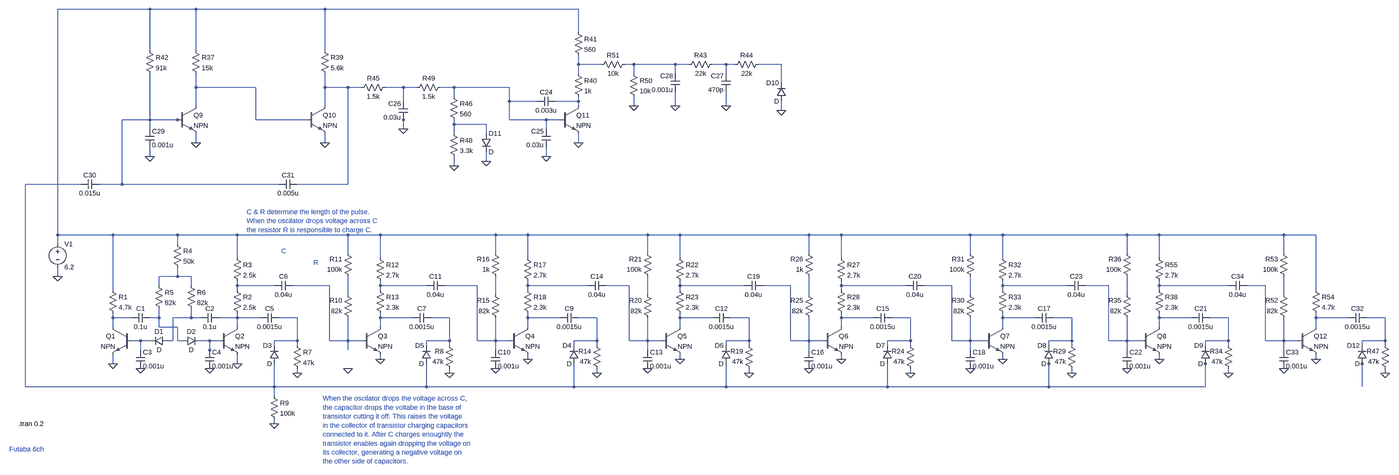
[diagram p0: schematic futaba-encoder-pulse-avalanche.asc, whole sheet]
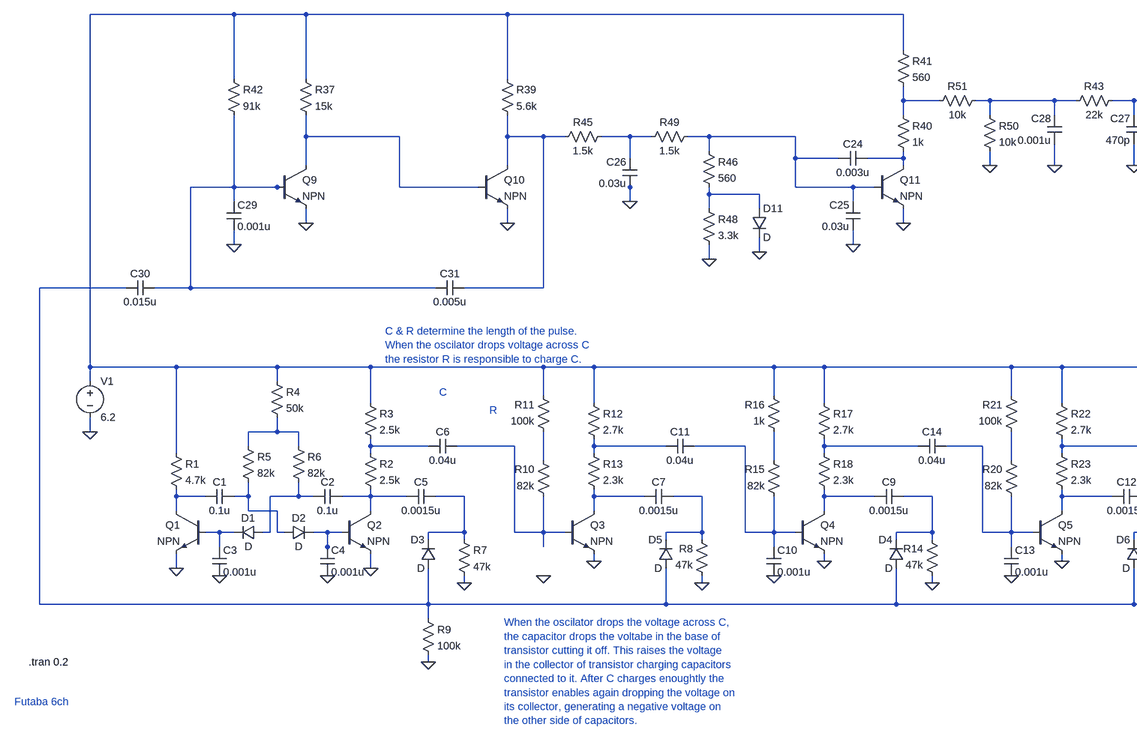
[diagram p1: schematic futaba-encoder-pulse-avalanche.asc, part, row 1 of 1, column 1 of 2]
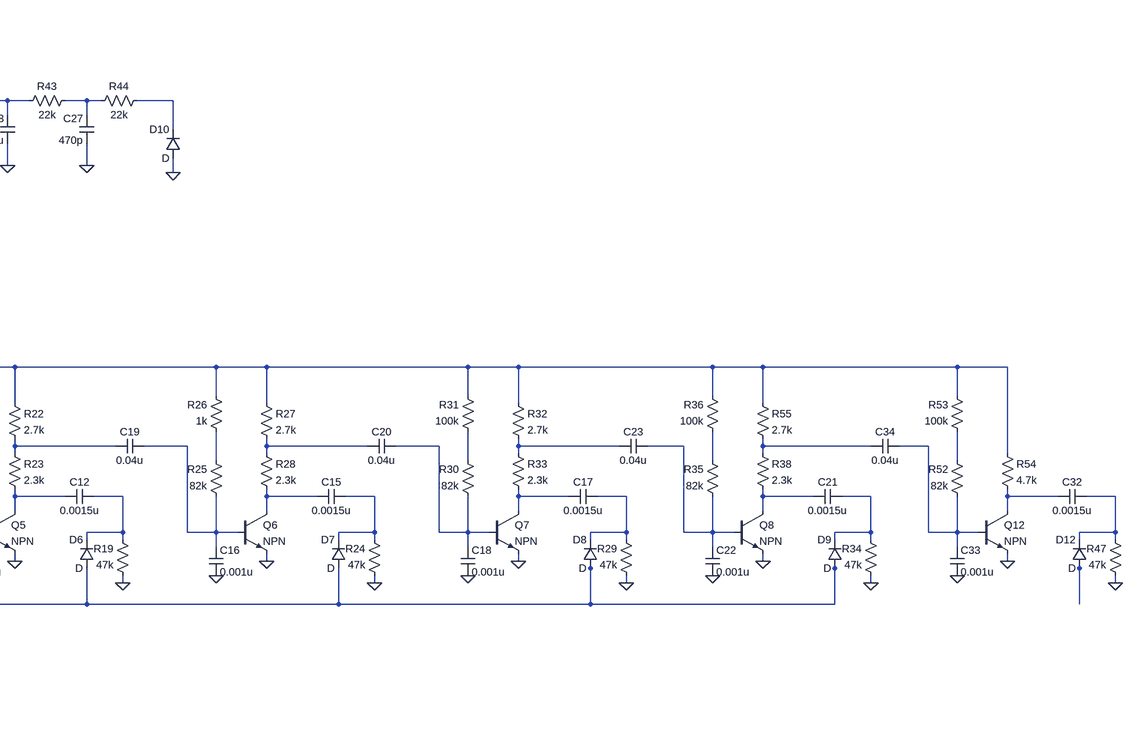
[diagram p2: schematic futaba-encoder-pulse-avalanche.asc, part, row 1 of 1, column 2 of 2]
futaba-encoder-pulse-avalanche.asc, the LTspice schematic file:
Version 4
SHEET 1 4308 792
WIRE 0 -752 -320 -752
WIRE 160 -752 0 -752
WIRE 608 -752 160 -752
WIRE 1488 -752 608 -752
WIRE 1488 -672 1488 -752
WIRE 0 -608 0 -752
WIRE 160 -608 160 -752
WIRE 608 -608 608 -752
WIRE 1488 -560 1488 -592
WIRE 1568 -560 1488 -560
WIRE 1680 -560 1648 -560
WIRE 1824 -560 1680 -560
WIRE 1872 -560 1824 -560
WIRE 2000 -560 1952 -560
WIRE 2032 -560 2000 -560
WIRE 2192 -560 2112 -560
WIRE 1488 -528 1488 -560
WIRE 1680 -528 1680 -560
WIRE 1824 -528 1824 -560
WIRE 2000 -528 2000 -560
WIRE 2192 -496 2192 -560
WIRE 160 -480 160 -528
WIRE 368 -480 160 -480
WIRE 608 -480 608 -528
WIRE 688 -480 608 -480
WIRE 736 -480 688 -480
WIRE 880 -480 816 -480
WIRE 928 -480 880 -480
WIRE 1056 -480 1008 -480
WIRE 1248 -480 1056 -480
WIRE 1056 -448 1056 -480
WIRE 880 -432 880 -480
WIRE 1248 -432 1248 -480
WIRE 1344 -432 1248 -432
WIRE 1488 -432 1488 -448
WIRE 1488 -432 1408 -432
WIRE 160 -416 160 -480
WIRE 608 -416 608 -480
WIRE 1488 -416 1488 -432
WIRE 1680 -416 1680 -448
WIRE 1824 -416 1824 -464
WIRE 2000 -416 2000 -464
WIRE 2192 -400 2192 -432
WIRE 0 -368 0 -528
WIRE 0 -368 -96 -368
WIRE 96 -368 0 -368
WIRE 112 -368 96 -368
WIRE 368 -368 368 -480
WIRE 544 -368 368 -368
WIRE 880 -368 880 -384
WIRE 1248 -368 1248 -432
WIRE 1376 -368 1248 -368
WIRE 1424 -368 1376 -368
WIRE 1056 -352 1056 -368
WIRE 1168 -352 1056 -352
WIRE 0 -336 0 -368
WIRE 880 -336 880 -368
WIRE 1376 -336 1376 -368
WIRE 1056 -320 1056 -352
WIRE 1168 -320 1168 -352
WIRE 160 -288 160 -320
WIRE 608 -288 608 -320
WIRE 1488 -288 1488 -320
WIRE 0 -240 0 -272
WIRE 1376 -240 1376 -272
WIRE 1168 -224 1168 -256
WIRE 1056 -208 1056 -240
WIRE -240 -144 -432 -144
WIRE -96 -144 -96 -368
WIRE -96 -144 -176 -144
WIRE 448 -144 -96 -144
WIRE 688 -144 688 -480
WIRE 688 -144 512 -144
WIRE -320 32 -320 -752
WIRE -128 32 -320 32
WIRE 96 32 -128 32
WIRE 304 32 96 32
WIRE 688 32 304 32
WIRE 800 32 688 32
WIRE 1200 32 800 32
WIRE 1312 32 1200 32
WIRE 1728 32 1312 32
WIRE 1840 32 1728 32
WIRE 2288 32 1840 32
WIRE 2400 32 2288 32
WIRE 2848 32 2400 32
WIRE 2960 32 2848 32
WIRE 3392 32 2960 32
WIRE 3504 32 3392 32
WIRE 3936 32 3504 32
WIRE 4048 32 3936 32
WIRE -320 64 -320 32
WIRE 96 64 96 32
WIRE 688 96 688 32
WIRE 1200 96 1200 32
WIRE 1728 96 1728 32
WIRE 2288 96 2288 32
WIRE 2848 96 2848 32
WIRE 3392 96 3392 32
WIRE 3936 96 3936 32
WIRE 304 112 304 32
WIRE 800 112 800 32
WIRE 1312 112 1312 32
WIRE 1840 112 1840 32
WIRE 2400 112 2400 32
WIRE 2960 112 2960 32
WIRE 3504 112 3504 32
WIRE -320 176 -320 144
WIRE 96 176 96 144
WIRE 96 176 32 176
WIRE 144 176 96 176
WIRE 32 208 32 176
WIRE 144 208 144 176
WIRE 304 208 304 192
WIRE 432 208 304 208
WIRE 624 208 496 208
WIRE 800 208 800 192
WIRE 960 208 800 208
WIRE 1136 208 1024 208
WIRE 1312 208 1312 192
WIRE 1520 208 1312 208
WIRE 1664 208 1584 208
WIRE 1840 208 1840 192
WIRE 2064 208 1840 208
WIRE 2224 208 2128 208
WIRE 2400 208 2400 192
WIRE 2624 208 2400 208
WIRE 2784 208 2688 208
WIRE 2960 208 2960 192
WIRE 3184 208 2960 208
WIRE 3328 208 3248 208
WIRE 3504 208 3504 192
WIRE 3744 208 3504 208
WIRE 3872 208 3808 208
WIRE -128 224 -128 32
WIRE 304 224 304 208
WIRE 800 224 800 208
WIRE 1312 224 1312 208
WIRE 1840 224 1840 208
WIRE 2400 224 2400 208
WIRE 2960 224 2960 208
WIRE 3504 224 3504 208
WIRE 4048 224 4048 32
WIRE 688 240 688 176
WIRE 1200 240 1200 176
WIRE 1728 240 1728 176
WIRE 2288 240 2288 176
WIRE 2848 240 2848 176
WIRE 3392 240 3392 176
WIRE 3936 240 3936 176
WIRE -128 320 -128 304
WIRE -64 320 -128 320
WIRE 32 320 32 288
WIRE 32 320 0 320
WIRE 144 320 144 288
WIRE 144 320 80 320
WIRE 176 320 144 320
WIRE 304 320 304 304
WIRE 304 320 240 320
WIRE 384 320 304 320
WIRE 512 320 448 320
WIRE 800 320 800 304
WIRE 912 320 800 320
WIRE 1040 320 976 320
WIRE 1312 320 1312 304
WIRE 1424 320 1312 320
WIRE 1552 320 1488 320
WIRE 1840 320 1840 304
WIRE 1952 320 1840 320
WIRE 2080 320 2016 320
WIRE 2400 320 2400 304
WIRE 2512 320 2400 320
WIRE 2640 320 2576 320
WIRE 2960 320 2960 304
WIRE 3072 320 2960 320
WIRE 3200 320 3136 320
WIRE 3504 320 3504 304
WIRE 3616 320 3504 320
WIRE 3744 320 3680 320
WIRE 4048 320 4048 304
WIRE 4160 320 4048 320
WIRE 4288 320 4224 320
WIRE -128 352 -128 320
WIRE 32 352 32 320
WIRE 96 352 32 352
WIRE 304 352 304 320
WIRE 800 352 800 320
WIRE 1312 352 1312 320
WIRE 1840 352 1840 320
WIRE 2400 352 2400 320
WIRE 2960 352 2960 320
WIRE 3504 352 3504 320
WIRE 4048 352 4048 320
WIRE -32 400 -64 400
WIRE 0 400 -32 400
WIRE 80 400 80 320
WIRE 80 400 64 400
WIRE 96 400 96 352
WIRE 112 400 96 400
WIRE 208 400 176 400
WIRE 240 400 208 400
WIRE 512 400 512 320
WIRE 512 400 432 400
WIRE 624 400 624 208
WIRE 688 400 688 320
WIRE 688 400 624 400
WIRE 736 400 688 400
WIRE 1040 400 1040 320
WIRE 1040 400 960 400
WIRE 1136 400 1136 208
WIRE 1200 400 1200 320
WIRE 1200 400 1136 400
WIRE 1248 400 1200 400
WIRE 1552 400 1552 320
WIRE 1552 400 1472 400
WIRE 1664 400 1664 208
WIRE 1728 400 1728 320
WIRE 1728 400 1664 400
WIRE 1776 400 1728 400
WIRE 2080 400 2080 320
WIRE 2080 400 2000 400
WIRE 2224 400 2224 208
WIRE 2288 400 2288 320
WIRE 2288 400 2224 400
WIRE 2336 400 2288 400
WIRE 2640 400 2640 320
WIRE 2640 400 2560 400
WIRE 2784 400 2784 208
WIRE 2848 400 2848 320
WIRE 2848 400 2784 400
WIRE 2896 400 2848 400
WIRE 3200 400 3200 320
WIRE 3200 400 3120 400
WIRE 3328 400 3328 208
WIRE 3392 400 3392 320
WIRE 3392 400 3328 400
WIRE 3440 400 3392 400
WIRE 3744 400 3744 320
WIRE 3744 400 3664 400
WIRE 3872 400 3872 208
WIRE 3936 400 3936 320
WIRE 3936 400 3872 400
WIRE 3984 400 3936 400
WIRE 4288 400 4288 320
WIRE 4288 400 4208 400
WIRE 432 416 432 400
WIRE 512 416 512 400
WIRE 960 416 960 400
WIRE 1040 416 1040 400
WIRE 1472 416 1472 400
WIRE 1552 416 1552 400
WIRE 2000 416 2000 400
WIRE 2080 416 2080 400
WIRE 2560 416 2560 400
WIRE 2640 416 2640 400
WIRE 3120 416 3120 400
WIRE 3200 416 3200 400
WIRE 3664 416 3664 400
WIRE 3744 416 3744 400
WIRE 4208 416 4208 400
WIRE 4288 416 4288 400
WIRE -32 432 -32 400
WIRE 208 432 208 400
WIRE 688 432 688 400
WIRE 1200 432 1200 400
WIRE 1728 432 1728 400
WIRE 2288 432 2288 400
WIRE 2848 432 2848 400
WIRE 3392 432 3392 400
WIRE 3936 432 3936 400
WIRE 208 448 208 432
WIRE 800 464 800 448
WIRE 1312 464 1312 448
WIRE 1840 464 1840 448
WIRE 2400 464 2400 448
WIRE 2960 464 2960 448
WIRE 3504 464 3504 448
WIRE 4048 464 4048 448
WIRE -128 480 -128 448
WIRE 304 480 304 448
WIRE 3120 480 3120 464
WIRE 3664 480 3664 464
WIRE 4208 480 4208 464
WIRE 512 512 512 496
WIRE 1040 512 1040 496
WIRE 1552 512 1552 496
WIRE 2080 512 2080 496
WIRE 2640 512 2640 496
WIRE 3200 512 3200 496
WIRE 3744 512 3744 496
WIRE 4288 512 4288 496
WIRE -432 560 -432 -144
WIRE 432 560 432 480
WIRE 432 560 -432 560
WIRE 960 560 960 480
WIRE 960 560 432 560
WIRE 1472 560 1472 480
WIRE 1472 560 960 560
WIRE 2000 560 2000 480
WIRE 2000 560 1472 560
WIRE 2560 560 2560 480
WIRE 2560 560 2000 560
WIRE 3120 560 3120 480
WIRE 3120 560 2560 560
WIRE 3664 560 3664 480
WIRE 3664 560 3120 560
WIRE 4208 560 4208 480
WIRE 432 592 432 560
WIRE 432 688 432 672
FLAG -128 480 0
FLAG 304 480 0
FLAG -320 176 0
FLAG 512 512 0
FLAG 432 688 0
FLAG 208 496 0
FLAG -32 496 0
FLAG 800 464 0
FLAG 1040 512 0
FLAG 688 496 0
FLAG 1312 464 0
FLAG 1552 512 0
FLAG 1200 496 0
FLAG 1840 464 0
FLAG 2080 512 0
FLAG 1728 496 0
FLAG 2400 464 0
FLAG 2640 512 0
FLAG 2288 496 0
FLAG 2960 464 0
FLAG 3200 512 0
FLAG 2848 496 0
FLAG 3504 464 0
FLAG 3744 512 0
FLAG 3392 496 0
FLAG 1488 -288 0
FLAG 608 -288 0
FLAG 160 -288 0
FLAG 1056 -208 0
FLAG 1168 -224 0
FLAG 880 -336 0
FLAG 1376 -240 0
FLAG 2192 -400 0
FLAG 1824 -416 0
FLAG 2000 -416 0
FLAG 1680 -416 0
FLAG 0 -240 0
FLAG 4048 464 0
FLAG 4288 512 0
FLAG 3936 496 0
SYMBOL npn -64 352 M0
SYMATTR InstName Q1
SYMBOL npn 240 352 R0
SYMATTR InstName Q2
SYMBOL Res -144 208 R0
SYMATTR InstName R1
SYMATTR Value 4.7k
SYMBOL Res 80 48 R0
SYMATTR InstName R4
SYMATTR Value 50k
SYMBOL Res 16 192 R0
SYMATTR InstName R5
SYMATTR Value 82k
SYMBOL Res 128 192 R0
SYMATTR InstName R6
SYMATTR Value 82k
SYMBOL Cap 0 304 R90
WINDOW 0 0 32 VBottom 2
WINDOW 3 32 32 VTop 2
SYMATTR InstName C1
SYMATTR Value 0.1u
SYMBOL Cap 240 304 R90
WINDOW 0 0 32 VBottom 2
WINDOW 3 32 32 VTop 2
SYMATTR InstName C2
SYMATTR Value 0.1u
SYMBOL Diode 64 384 R90
WINDOW 0 0 32 VBottom 2
WINDOW 3 32 32 VTop 2
SYMATTR InstName D1
SYMBOL Diode 112 384 M90
WINDOW 0 0 32 VBottom 2
WINDOW 3 32 32 VTop 2
SYMATTR InstName D2
SYMBOL Res 288 208 R0
SYMATTR InstName R2
SYMATTR Value 2.5k
SYMBOL Res 288 96 R0
SYMATTR InstName R3
SYMATTR Value 2.5k
SYMBOL Voltage -320 48 R0
SYMATTR InstName V1
SYMATTR Value 6.2
SYMBOL Cap 448 304 R90
WINDOW 0 0 32 VBottom 2
WINDOW 3 32 32 VTop 2
SYMATTR InstName C5
SYMATTR Value 0.0015u
SYMBOL Res 496 400 R0
SYMATTR InstName R7
SYMATTR Value 47k
SYMBOL Diode 448 480 R180
WINDOW 0 24 64 Left 2
WINDOW 3 24 0 Left 2
SYMATTR InstName D3
SYMBOL Res 416 576 R0
SYMATTR InstName R9
SYMATTR Value 100k
SYMBOL Cap -48 432 R0
SYMATTR InstName C3
SYMATTR Value 0.001u
SYMBOL Cap 192 432 R0
SYMATTR InstName C4
SYMATTR Value 0.001u
SYMBOL Cap 496 192 R90
WINDOW 0 0 32 VBottom 2
WINDOW 3 32 32 VTop 2
SYMATTR InstName C6
SYMATTR Value 0.04u
SYMBOL npn 736 352 R0
SYMATTR InstName Q3
SYMBOL Diode 976 480 R180
WINDOW 0 24 64 Left 2
WINDOW 3 24 0 Left 2
SYMATTR InstName D5
SYMBOL Res 1056 512 R180
WINDOW 0 36 76 Left 2
WINDOW 3 36 40 Left 2
SYMATTR InstName R8
SYMATTR Value 47k
SYMBOL Res 704 336 R180
WINDOW 0 36 76 Left 2
WINDOW 3 36 40 Left 2
SYMATTR InstName R10
SYMATTR Value 82k
SYMBOL Res 704 192 R180
WINDOW 0 36 76 Left 2
WINDOW 3 36 40 Left 2
SYMATTR InstName R11
SYMATTR Value 100k
SYMBOL Cap 976 304 R90
WINDOW 0 0 32 VBottom 2
WINDOW 3 32 32 VTop 2
SYMATTR InstName C7
SYMATTR Value 0.0015u
SYMBOL Res 784 96 R0
SYMATTR InstName R12
SYMATTR Value 2.7k
SYMBOL Res 784 208 R0
SYMATTR InstName R13
SYMATTR Value 2.3k
SYMBOL npn 1248 352 R0
SYMATTR InstName Q4
SYMBOL Diode 1488 480 R180
WINDOW 0 24 64 Left 2
WINDOW 3 24 0 Left 2
SYMATTR InstName D4
SYMBOL Res 1568 512 R180
WINDOW 0 36 76 Left 2
WINDOW 3 36 40 Left 2
SYMATTR InstName R14
SYMATTR Value 47k
SYMBOL Res 1216 336 R180
WINDOW 0 36 76 Left 2
WINDOW 3 36 40 Left 2
SYMATTR InstName R15
SYMATTR Value 82k
SYMBOL Res 1216 192 R180
WINDOW 0 36 76 Left 2
WINDOW 3 36 40 Left 2
SYMATTR InstName R16
SYMATTR Value 1k
SYMBOL Cap 1488 304 R90
WINDOW 0 0 32 VBottom 2
WINDOW 3 32 32 VTop 2
SYMATTR InstName C9
SYMATTR Value 0.0015u
SYMBOL Res 1296 96 R0
SYMATTR InstName R17
SYMATTR Value 2.7k
SYMBOL Res 1296 208 R0
SYMATTR InstName R18
SYMATTR Value 2.3k
SYMBOL Cap 1184 432 R0
SYMATTR InstName C10
SYMATTR Value 0.001u
SYMBOL Cap 1024 192 R90
WINDOW 0 0 32 VBottom 2
WINDOW 3 32 32 VTop 2
SYMATTR InstName C11
SYMATTR Value 0.04u
SYMBOL npn 1776 352 R0
SYMATTR InstName Q5
SYMBOL Diode 2016 480 R180
WINDOW 0 24 64 Left 2
WINDOW 3 24 0 Left 2
SYMATTR InstName D6
SYMBOL Res 2096 512 R180
WINDOW 0 36 76 Left 2
WINDOW 3 36 40 Left 2
SYMATTR InstName R19
SYMATTR Value 47k
SYMBOL Res 1744 336 R180
WINDOW 0 36 76 Left 2
WINDOW 3 36 40 Left 2
SYMATTR InstName R20
SYMATTR Value 82k
SYMBOL Res 1744 192 R180
WINDOW 0 36 76 Left 2
WINDOW 3 36 40 Left 2
SYMATTR InstName R21
SYMATTR Value 100k
SYMBOL Cap 2016 304 R90
WINDOW 0 0 32 VBottom 2
WINDOW 3 32 32 VTop 2
SYMATTR InstName C12
SYMATTR Value 0.0015u
SYMBOL Res 1824 96 R0
SYMATTR InstName R22
SYMATTR Value 2.7k
SYMBOL Res 1824 208 R0
SYMATTR InstName R23
SYMATTR Value 2.3k
SYMBOL Cap 1712 432 R0
SYMATTR InstName C13
SYMATTR Value 0.001u
SYMBOL Cap 1584 192 R90
WINDOW 0 0 32 VBottom 2
WINDOW 3 32 32 VTop 2
SYMATTR InstName C14
SYMATTR Value 0.04u
SYMBOL npn 2336 352 R0
SYMATTR InstName Q6
SYMBOL Diode 2576 480 R180
WINDOW 0 24 64 Left 2
WINDOW 3 24 0 Left 2
SYMATTR InstName D7
SYMBOL Res 2656 512 R180
WINDOW 0 36 76 Left 2
WINDOW 3 36 40 Left 2
SYMATTR InstName R24
SYMATTR Value 47k
SYMBOL Res 2304 336 R180
WINDOW 0 36 76 Left 2
WINDOW 3 36 40 Left 2
SYMATTR InstName R25
SYMATTR Value 82k
SYMBOL Res 2304 192 R180
WINDOW 0 36 76 Left 2
WINDOW 3 36 40 Left 2
SYMATTR InstName R26
SYMATTR Value 1k
SYMBOL Cap 2576 304 R90
WINDOW 0 0 32 VBottom 2
WINDOW 3 32 32 VTop 2
SYMATTR InstName C15
SYMATTR Value 0.0015u
SYMBOL Res 2384 96 R0
SYMATTR InstName R27
SYMATTR Value 2.7k
SYMBOL Res 2384 208 R0
SYMATTR InstName R28
SYMATTR Value 2.3k
SYMBOL Cap 2272 432 R0
SYMATTR InstName C16
SYMATTR Value 0.001u
SYMBOL npn 2896 352 R0
SYMATTR InstName Q7
SYMBOL Diode 3136 480 R180
WINDOW 0 24 64 Left 2
WINDOW 3 24 0 Left 2
SYMATTR InstName D8
SYMBOL Res 3216 512 R180
WINDOW 0 36 76 Left 2
WINDOW 3 36 40 Left 2
SYMATTR InstName R29
SYMATTR Value 47k
SYMBOL Res 2864 336 R180
WINDOW 0 36 76 Left 2
WINDOW 3 36 40 Left 2
SYMATTR InstName R30
SYMATTR Value 82k
SYMBOL Res 2864 192 R180
WINDOW 0 36 76 Left 2
WINDOW 3 36 40 Left 2
SYMATTR InstName R31
SYMATTR Value 100k
SYMBOL Cap 3136 304 R90
WINDOW 0 0 32 VBottom 2
WINDOW 3 32 32 VTop 2
SYMATTR InstName C17
SYMATTR Value 0.0015u
SYMBOL Res 2944 96 R0
SYMATTR InstName R32
SYMATTR Value 2.7k
SYMBOL Res 2944 208 R0
SYMATTR InstName R33
SYMATTR Value 2.3k
SYMBOL Cap 2832 432 R0
SYMATTR InstName C18
SYMATTR Value 0.001u
SYMBOL Cap 2128 192 R90
WINDOW 0 0 32 VBottom 2
WINDOW 3 32 32 VTop 2
SYMATTR InstName C19
SYMATTR Value 0.04u
SYMBOL Cap 2688 192 R90
WINDOW 0 0 32 VBottom 2
WINDOW 3 32 32 VTop 2
SYMATTR InstName C20
SYMATTR Value 0.04u
SYMBOL npn 3440 352 R0
SYMATTR InstName Q8
SYMBOL Diode 3680 480 R180
WINDOW 0 24 64 Left 2
WINDOW 3 24 0 Left 2
SYMATTR InstName D9
SYMBOL Res 3760 512 R180
WINDOW 0 36 76 Left 2
WINDOW 3 36 40 Left 2
SYMATTR InstName R34
SYMATTR Value 47k
SYMBOL Res 3408 336 R180
WINDOW 0 36 76 Left 2
WINDOW 3 36 40 Left 2
SYMATTR InstName R35
SYMATTR Value 82k
SYMBOL Res 3408 192 R180
WINDOW 0 36 76 Left 2
WINDOW 3 36 40 Left 2
SYMATTR InstName R36
SYMATTR Value 100k
SYMBOL Cap 3680 304 R90
WINDOW 0 0 32 VBottom 2
WINDOW 3 32 32 VTop 2
SYMATTR InstName C21
SYMATTR Value 0.0015u
SYMBOL Res 3488 208 R0
SYMATTR InstName R38
SYMATTR Value 2.3k
SYMBOL Cap 3376 432 R0
SYMATTR InstName C22
SYMATTR Value 0.001u
SYMBOL Cap 3248 192 R90
WINDOW 0 0 32 VBottom 2
WINDOW 3 32 32 VTop 2
SYMATTR InstName C23
SYMATTR Value 0.04u
SYMBOL npn 96 -416 R0
SYMATTR InstName Q9
SYMBOL npn 544 -416 R0
SYMATTR InstName Q10
SYMBOL npn 1424 -416 R0
SYMATTR InstName Q11
SYMBOL Res 144 -624 R0
SYMATTR InstName R37
SYMATTR Value 15k
SYMBOL Res 592 -624 R0
SYMATTR InstName R39
SYMATTR Value 5.6k
SYMBOL Res 1472 -544 R0
SYMATTR InstName R40
SYMATTR Value 1k
SYMBOL Res 1472 -688 R0
SYMATTR InstName R41
SYMATTR Value 560
SYMBOL Res -16 -624 R0
SYMATTR InstName R42
SYMATTR Value 91k
SYMBOL Res 1968 -576 R90
WINDOW 0 0 56 VBottom 2
WINDOW 3 32 56 VTop 2
SYMATTR InstName R43
SYMATTR Value 22k
SYMBOL Res 2128 -576 R90
WINDOW 0 0 56 VBottom 2
WINDOW 3 32 56 VTop 2
SYMATTR InstName R44
SYMATTR Value 22k
SYMBOL Diode 2208 -432 R180
WINDOW 0 24 64 Left 2
WINDOW 3 24 0 Left 2
SYMATTR InstName D10
SYMBOL Cap 1408 -448 R90
WINDOW 0 0 32 VBottom 2
WINDOW 3 32 32 VTop 2
SYMATTR InstName C24
SYMATTR Value 0.003u
SYMBOL Cap 1392 -272 R180
WINDOW 0 24 56 Left 2
WINDOW 3 24 8 Left 2
SYMATTR InstName C25
SYMATTR Value 0.03u
SYMBOL Cap 896 -368 R180
WINDOW 0 24 56 Left 2
WINDOW 3 24 8 Left 2
SYMATTR InstName C26
SYMATTR Value 0.03u
SYMBOL Res 832 -496 R90
WINDOW 0 0 56 VBottom 2
WINDOW 3 32 56 VTop 2
SYMATTR InstName R45
SYMATTR Value 1.5k
SYMBOL Res 1040 -464 R0
SYMATTR InstName R46
SYMATTR Value 560
SYMBOL Res 1040 -336 R0
SYMATTR InstName R48
SYMATTR Value 3.3k
SYMBOL Diode 1152 -320 R0
SYMATTR InstName D11
SYMBOL Res 1024 -496 R90
WINDOW 0 0 56 VBottom 2
WINDOW 3 32 56 VTop 2
SYMATTR InstName R49
SYMATTR Value 1.5k
SYMBOL Cap 2016 -464 R180
WINDOW 0 24 56 Left 2
WINDOW 3 24 8 Left 2
SYMATTR InstName C27
SYMATTR Value 470p
SYMBOL Cap 1840 -464 R180
WINDOW 0 24 56 Left 2
WINDOW 3 24 8 Left 2
SYMATTR InstName C28
SYMATTR Value 0.001u
SYMBOL Res 1664 -544 R0
SYMATTR InstName R50
SYMATTR Value 10k
SYMBOL Res 1664 -576 R90
WINDOW 0 0 56 VBottom 2
WINDOW 3 32 56 VTop 2
SYMATTR InstName R51
SYMATTR Value 10k
SYMBOL Cap -16 -336 R0
SYMATTR InstName C29
SYMATTR Value 0.001u
SYMBOL Cap -176 -160 R90
WINDOW 0 0 32 VBottom 2
WINDOW 3 32 32 VTop 2
SYMATTR InstName C30
SYMATTR Value 0.015u
SYMBOL Cap 512 -160 R90
WINDOW 0 0 32 VBottom 2
WINDOW 3 32 32 VTop 2
SYMATTR InstName C31
SYMATTR Value 0.005u
SYMBOL npn 3984 352 R0
SYMATTR InstName Q12
SYMBOL Diode 4224 480 R180
WINDOW 0 24 64 Left 2
WINDOW 3 24 0 Left 2
SYMATTR InstName D12
SYMBOL Res 4304 512 R180
WINDOW 0 36 76 Left 2
WINDOW 3 36 40 Left 2
SYMATTR InstName R47
SYMATTR Value 47k
SYMBOL Res 3952 336 R180
WINDOW 0 36 76 Left 2
WINDOW 3 36 40 Left 2
SYMATTR InstName R52
SYMATTR Value 82k
SYMBOL Res 3952 192 R180
WINDOW 0 36 76 Left 2
WINDOW 3 36 40 Left 2
SYMATTR InstName R53
SYMATTR Value 100k
SYMBOL Cap 4224 304 R90
WINDOW 0 0 32 VBottom 2
WINDOW 3 32 32 VTop 2
SYMATTR InstName C32
SYMATTR Value 0.0015u
SYMBOL Res 4032 208 R0
SYMATTR InstName R54
SYMATTR Value 4.7k
SYMBOL Cap 3920 432 R0
SYMATTR InstName C33
SYMATTR Value 0.001u
SYMBOL Cap 3808 192 R90
WINDOW 0 0 32 VBottom 2
WINDOW 3 32 32 VTop 2
SYMATTR InstName C34
SYMATTR Value 0.04u
SYMBOL Res 3488 96 R0
SYMATTR InstName R55
SYMATTR Value 2.7k
TEXT -456 688 Left 2 !.tran 0.2
TEXT -488 776 Left 2 ;Futaba 6ch
TEXT 456 88 Left 2 ;C
TEXT 568 128 Left 2 ;R
TEXT 336 -48 Left 2 ;C & R determine the length of the pulse.\nWhen the oscilator drops voltage across C\nthe resistor R is responsible to charge C.
TEXT 600 600 Left 2 ;When the oscilator drops the voltage across C,\nthe capacitor drops the voltabe in the base of\ntransistor cutting it off. This raises the voltage\nin the collector of transistor charging capacitors\nconnected to it. After C charges enoughtly the\ntransistor enables again dropping the voltage on\nits collector, generating a negative voltage on\nthe other side of capacitors.

The netlist it stands for:
* futaba-encoder-pulse-avalanche.asc
Q1 N036 N055 0 0 NPN
Q2 N039 N056 0 0 NPN
R1 N001 N036 4.7k
R4 N001 N014 50k
R5 N014 N037 82k
R6 N014 N038 82k
C1 N037 N036 0.1u
C2 N039 N038 0.1u
D1 N038 N055 D
D2 N037 N056 D
R2 N015 N039 2.5k
R3 N001 N015 2.5k
V1 N001 0 6.2
C5 N040 N039 0.0015u
R7 N040 0 47k
D3 N013 N040 D
R9 N013 0 100k
C3 N055 0 0.001u
C4 N056 0 0.001u
C6 N016 N015 0.04u
Q3 N041 N016 0 0 NPN
D5 N013 N042 D
R8 0 N042 47k
R10 N016 N029 82k
R11 N029 N001 100k
C7 N042 N041 0.0015u
R12 N001 N017 2.7k
R13 N017 N041 2.3k
Q4 N043 N018 0 0 NPN
D4 N013 N044 D
R14 0 N044 47k
R15 N018 N030 82k
R16 N030 N001 1k
C9 N044 N043 0.0015u
R17 N001 N019 2.7k
R18 N019 N043 2.3k
C10 N018 0 0.001u
C11 N018 N017 0.04u
Q5 N045 N020 0 0 NPN
D6 N013 N046 D
R19 0 N046 47k
R20 N020 N031 82k
R21 N031 N001 100k
C12 N046 N045 0.0015u
R22 N001 N021 2.7k
R23 N021 N045 2.3k
C13 N020 0 0.001u
C14 N020 N019 0.04u
Q6 N047 N022 0 0 NPN
D7 N013 N048 D
R24 0 N048 47k
R25 N022 N032 82k
R26 N032 N001 1k
C15 N048 N047 0.0015u
R27 N001 N023 2.7k
R28 N023 N047 2.3k
C16 N022 0 0.001u
Q7 N049 N024 0 0 NPN
D8 N013 N050 D
R29 0 N050 47k
R30 N024 N033 82k
R31 N033 N001 100k
C17 N050 N049 0.0015u
R32 N001 N025 2.7k
R33 N025 N049 2.3k
C18 N024 0 0.001u
C19 N022 N021 0.04u
C20 N024 N023 0.04u
Q8 N051 N026 0 0 NPN
D9 N013 N052 D
R34 0 N052 47k
R35 N026 N034 82k
R36 N034 N001 100k
C21 N052 N051 0.0015u
R38 N027 N051 2.3k
C22 N026 0 0.001u
C23 N026 N025 0.04u
Q9 N006 N011 0 0 NPN
Q10 N007 N006 0 0 NPN
Q11 N010 N009 0 0 NPN
R37 N001 N006 15k
R39 N001 N007 5.6k
R40 N002 N010 1k
R41 N001 N002 560
R42 N001 N011 91k
R43 N004 N003 22k
R44 N005 N004 22k
D10 0 N005 D
C24 N010 N009 0.003u
C25 0 N009 0.03u
C26 0 N008 0.03u
R45 N008 N007 1.5k
R46 N009 N012 560
R48 N012 0 3.3k
D11 N012 0 D
R49 N009 N008 1.5k
C27 0 N004 470p
C28 0 N003 0.001u
R50 N003 0 10k
R51 N003 N002 10k
C29 N011 0 0.001u
C30 N011 N013 0.015u
C31 N007 N011 0.005u
Q12 N053 N028 0 0 NPN
D12 N057 N054 D
R47 0 N054 47k
R52 N028 N035 82k
R53 N035 N001 100k
C32 N054 N053 0.0015u
R54 N001 N053 4.7k
C33 N028 0 0.001u
C34 N028 N027 0.04u
R55 N001 N027 2.7k
.model D D
.lib standard.dio
.model NPN NPN
.model PNP PNP
.lib standard.bjt
.tran 0.2
* Futaba 6ch
* C
* R
* C & R determine the length of the pulse.
* When the oscilator drops voltage across C
* the resistor R is responsible to charge C.
* When the oscilator drops the voltage across C,
* the capacitor drops the voltabe in the base of
* transistor cutting it off. This raises the voltage
* in the collector of transistor charging capacitors
* connected to it. After C charges enoughtly the
* transistor enables again dropping the voltage on
* its collector, generating a negative voltage on
* the other side of capacitors.
.backanno
.end